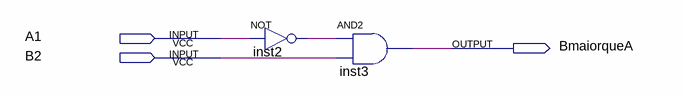
[diagram p0: schematic sheet]
// Quartus schematic blocoBmaiorqueA.bdf as structural Verilog: 2 symbols, 3 pins
module blocoBmaiorqueA (
  input  A1,
  input  B2,
  output BmaiorqueA
);

  wire inst2_out;

  not inst2 (inst2_out, A1);
  and inst3 (BmaiorqueA, inst2_out, B2);
endmodule
